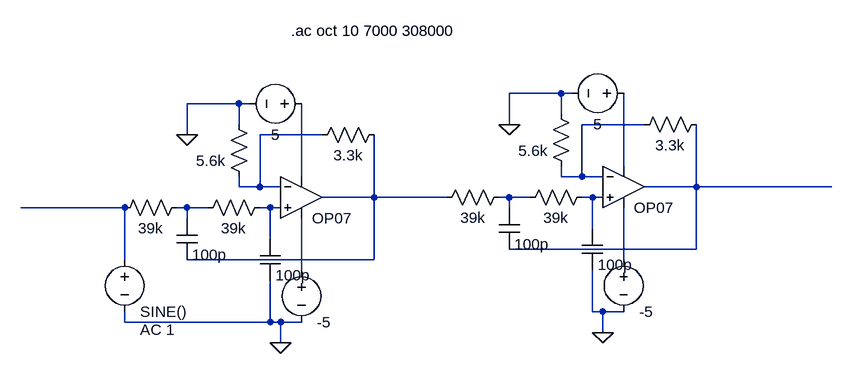
[diagram p0: schematic LPF_4th_Order.asc]
LPF_4th_Order.asc, the LTspice schematic file:
Version 4
SHEET 1 948 680
WIRE 528 16 448 16
WIRE 544 16 528 16
WIRE 32 32 -48 32
WIRE 48 32 32 32
WIRE 528 48 528 16
WIRE 32 64 32 32
WIRE 448 64 448 16
WIRE 656 64 560 64
WIRE -48 80 -48 32
WIRE 160 80 64 80
WIRE 624 128 624 16
WIRE 128 144 128 32
WIRE 528 144 528 128
WIRE 560 144 560 64
WIRE 560 144 528 144
WIRE 592 144 560 144
WIRE 32 160 32 144
WIRE 64 160 64 80
WIRE 64 160 32 160
WIRE 96 160 64 160
WIRE 736 160 736 64
WIRE 736 160 656 160
WIRE 944 160 736 160
WIRE 240 176 240 80
WIRE 240 176 160 176
WIRE 352 176 240 176
WIRE 448 176 432 176
WIRE 480 176 448 176
WIRE 576 176 560 176
WIRE 592 176 576 176
WIRE -144 192 -304 192
WIRE -48 192 -64 192
WIRE -16 192 -48 192
WIRE 80 192 64 192
WIRE 96 192 80 192
WIRE 448 192 448 176
WIRE -48 208 -48 192
WIRE 576 224 576 176
WIRE 80 240 80 192
WIRE 736 256 736 160
WIRE 736 256 448 256
WIRE -144 272 -144 192
WIRE 240 272 240 176
WIRE 240 272 -48 272
WIRE 624 272 624 192
WIRE 128 288 128 208
WIRE 576 352 576 288
WIRE 592 352 576 352
WIRE 624 352 592 352
WIRE -144 368 -144 352
WIRE 80 368 80 304
WIRE 80 368 -144 368
WIRE 96 368 80 368
WIRE 128 368 96 368
WIRE 592 384 592 352
WIRE 96 400 96 368
FLAG 96 400 0
FLAG -48 80 0
FLAG 592 384 0
FLAG 448 64 0
SYMBOL Opamps\\OP07 128 112 R0
WINDOW 0 16 32 Invisible 2
SYMATTR InstName U1
SYMBOL res 80 176 R90
WINDOW 0 0 56 Invisible 2
WINDOW 3 32 56 VTop 2
SYMATTR InstName R1
SYMATTR Value 39k
SYMBOL res -48 176 R90
WINDOW 0 0 56 Invisible 2
WINDOW 3 32 56 VTop 2
SYMATTR InstName R2
SYMATTR Value 39k
SYMBOL res 256 64 R90
WINDOW 0 0 56 Invisible 2
WINDOW 3 32 56 VTop 2
SYMATTR InstName R3
SYMATTR Value 3.3k
SYMBOL res 48 160 R180
WINDOW 0 36 76 Invisible 2
WINDOW 3 36 40 Left 2
SYMATTR InstName R4
SYMATTR Value 5.6k
SYMBOL cap -64 208 R0
WINDOW 0 24 8 Invisible 2
SYMATTR InstName C1
SYMATTR Value 100p
SYMBOL voltage 144 32 R90
WINDOW 0 -32 56 Invisible 2
WINDOW 3 32 56 VTop 2
WINDOW 123 0 0 Left 2
WINDOW 39 0 0 Left 2
SYMATTR InstName V1
SYMATTR Value 5
SYMBOL voltage 128 272 R0
WINDOW 0 24 16 Invisible 2
WINDOW 123 0 0 Left 2
WINDOW 39 0 0 Left 2
SYMATTR InstName V2
SYMATTR Value -5
SYMBOL voltage -144 256 R0
WINDOW 0 24 16 Invisible 2
WINDOW 123 24 124 Left 2
WINDOW 39 0 0 Left 2
SYMATTR InstName V3
SYMATTR Value2 AC 1
SYMATTR Value SINE()
SYMBOL cap 64 240 R0
WINDOW 0 24 8 Invisible 2
SYMATTR InstName C2
SYMATTR Value 100p
SYMBOL Opamps\\OP07 624 96 R0
WINDOW 0 16 32 Invisible 2
SYMATTR InstName U2
SYMBOL res 576 160 R90
WINDOW 0 0 56 Invisible 2
WINDOW 3 32 56 VTop 2
SYMATTR InstName R5
SYMATTR Value 39k
SYMBOL res 448 160 R90
WINDOW 0 0 56 Invisible 2
WINDOW 3 32 56 VTop 2
SYMATTR InstName R6
SYMATTR Value 39k
SYMBOL res 752 48 R90
WINDOW 0 0 56 Invisible 2
WINDOW 3 32 56 VTop 2
SYMATTR InstName R7
SYMATTR Value 3.3k
SYMBOL res 544 144 R180
WINDOW 0 36 76 Invisible 2
WINDOW 3 36 40 Left 2
SYMATTR InstName R8
SYMATTR Value 5.6k
SYMBOL cap 432 192 R0
WINDOW 0 24 8 Invisible 2
SYMATTR InstName C3
SYMATTR Value 100p
SYMBOL voltage 640 16 R90
WINDOW 0 -32 56 Invisible 2
WINDOW 3 32 56 VTop 2
WINDOW 123 0 0 Left 2
WINDOW 39 0 0 Left 2
SYMATTR InstName V4
SYMATTR Value 5
SYMBOL voltage 624 256 R0
WINDOW 0 24 16 Invisible 2
WINDOW 123 0 0 Left 2
WINDOW 39 0 0 Left 2
SYMATTR InstName V5
SYMATTR Value -5
SYMBOL cap 560 224 R0
WINDOW 0 24 8 Invisible 2
SYMATTR InstName C4
SYMATTR Value 100p
TEXT 112 -80 Left 2 !.ac oct 10 7000 308000

The netlist it stands for:
* LPF_4th_Order.asc
XU1 N011 N002 N004 N013 N006 LT1001  ; OP07, pins In+ In- V+ V- OUT
R1 N011 N010 39k
R2 N010 N009 39k
R3 N006 N002 3.3k
R4 N002 0 5.6k
C1 N010 N006 100p
V1 N004 0 5
V2 N013 0 -5
V3 N009 0 SINE() AC 1
C2 N011 0 100p
XU2 N008 N001 N003 N012 N005 LT1001  ; OP07, pins In+ In- V+ V- OUT
R5 N008 N007 39k
R6 N007 N006 39k
R7 N005 N001 3.3k
R8 N001 0 5.6k
C3 N007 N005 100p
V4 N003 0 5
V5 N012 0 -5
C4 N008 0 100p
.ac oct 10 7000 308000
.lib LTC.lib
.backanno
.end